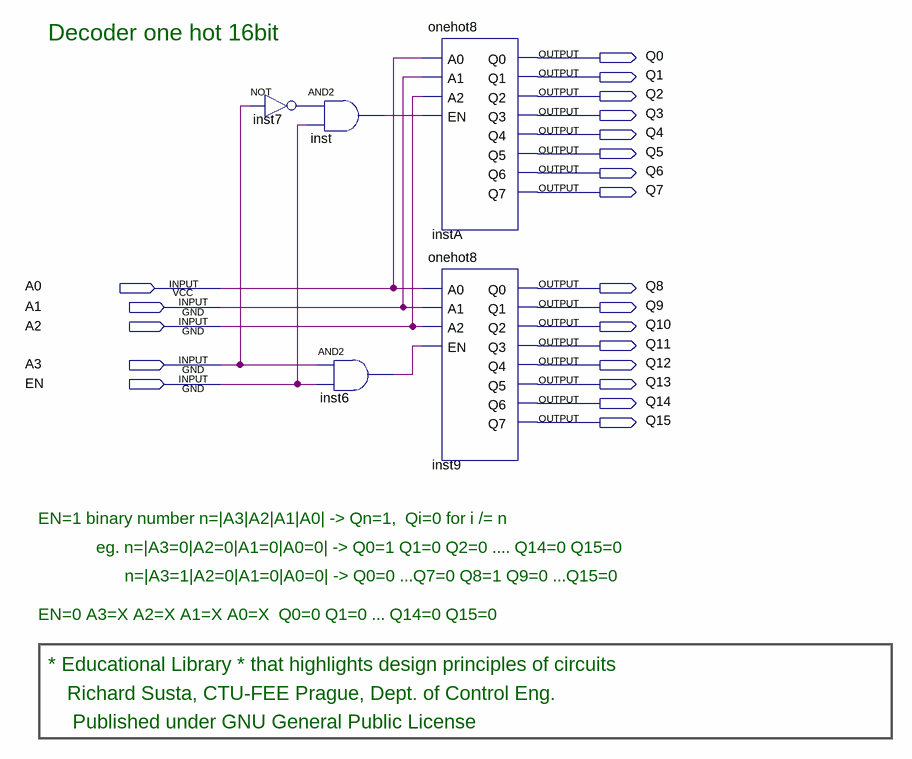
[diagram p0: schematic sheet]
// Quartus schematic onehot16.bdf as structural Verilog: 5 symbols, 21 pins
module onehot16 (
  input  A0,
  input  A1,
  input  A2,
  input  A3,
  input  EN,
  output Q0,
  output Q1,
  output Q2,
  output Q3,
  output Q4,
  output Q5,
  output Q6,
  output Q7,
  output Q8,
  output Q9,
  output Q10,
  output Q11,
  output Q12,
  output Q13,
  output Q14,
  output Q15
);

  wire inst6_out, inst7_out, inst_out;

  not inst7 (inst7_out, A3);
  and inst (inst_out, inst7_out, EN);
  and inst6 (inst6_out, A3, EN);
  onehot8 instA (
    .A0(A0), .A1(A1), .A2(A2), .EN(inst_out), .Q0(Q0), .Q1(Q1), .Q2(Q2), .Q3(Q3), .Q4(Q4), .Q5(Q5), .Q6(Q6),
    .Q7(Q7));
  onehot8 inst9 (
    .A0(A0), .A1(A1), .A2(A2), .EN(inst6_out), .Q0(Q8), .Q1(Q9), .Q2(Q10), .Q3(Q11), .Q4(Q12), .Q5(Q13),
    .Q6(Q14), .Q7(Q15));

  // Notes on the sheet:
  //   Decoder one hot 16bit
  //   EN=1 binary number n=|A3|A2|A1|A0| -> Qn=1,  Qi=0 for i /= n
  //   eg. n=|A3=0|A2=0|A1=0|A0=0| -> Q0=1 Q1=0 Q2=0 .... Q14=0 Q15=0
  //   n=|A3=1|A2=0|A1=0|A0=0| -> Q0=0 ...Q7=0 Q8=1 Q9=0 ...Q15=0
  //   EN=0 A3=X A2=X A1=X A0=X  Q0=0 Q1=0 ... Q14=0 Q15=0
  //   * Educational Library * that highlights design principles of circuits
  //   Richard Susta, CTU-FEE Prague, Dept. of Control Eng. 
  //    Published under GNU General Public License
endmodule
